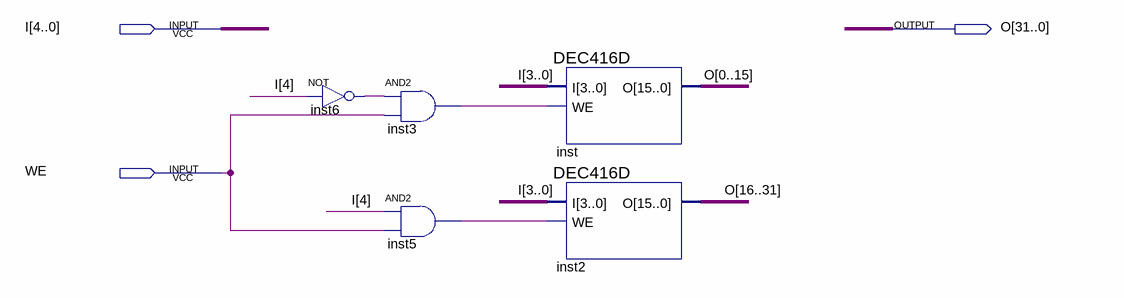
[diagram p0: schematic sheet]
// Quartus schematic DEC532D.bdf as structural Verilog: 5 symbols, 3 pins
module DEC532D (
  input  [4:0] I,
  input  WE,
  output [31:0] O
);

  wire inst3_out, inst5_out, inst6_out;

  not inst6 (inst6_out, I[4]);
  and inst3 (inst3_out, inst6_out, WE);
  and inst5 (inst5_out, I[4], WE);
  DEC416D inst (
    .I(I[3:0]), .WE(inst3_out),
    .O({O[0], O[1], O[2], O[3], O[4], O[5], O[6], O[7], O[8], O[9], O[10], O[11], O[12], O[13], O[14], O[15]}));
  DEC416D inst2 (
    .I(I[3:0]), .WE(inst5_out),
    .O({O[16], O[17], O[18], O[19], O[20], O[21], O[22], O[23], O[24], O[25], O[26], O[27], O[28], O[29], O[30], O[31]}));
endmodule
